# Altium schematic sheet DB10011_CANTranceiver.SchDoc: CAN Transceiver
size A4; Engineer: Danny Bokma; Revision: V0.3; SheetNumber: 6; SheetTotal: 7
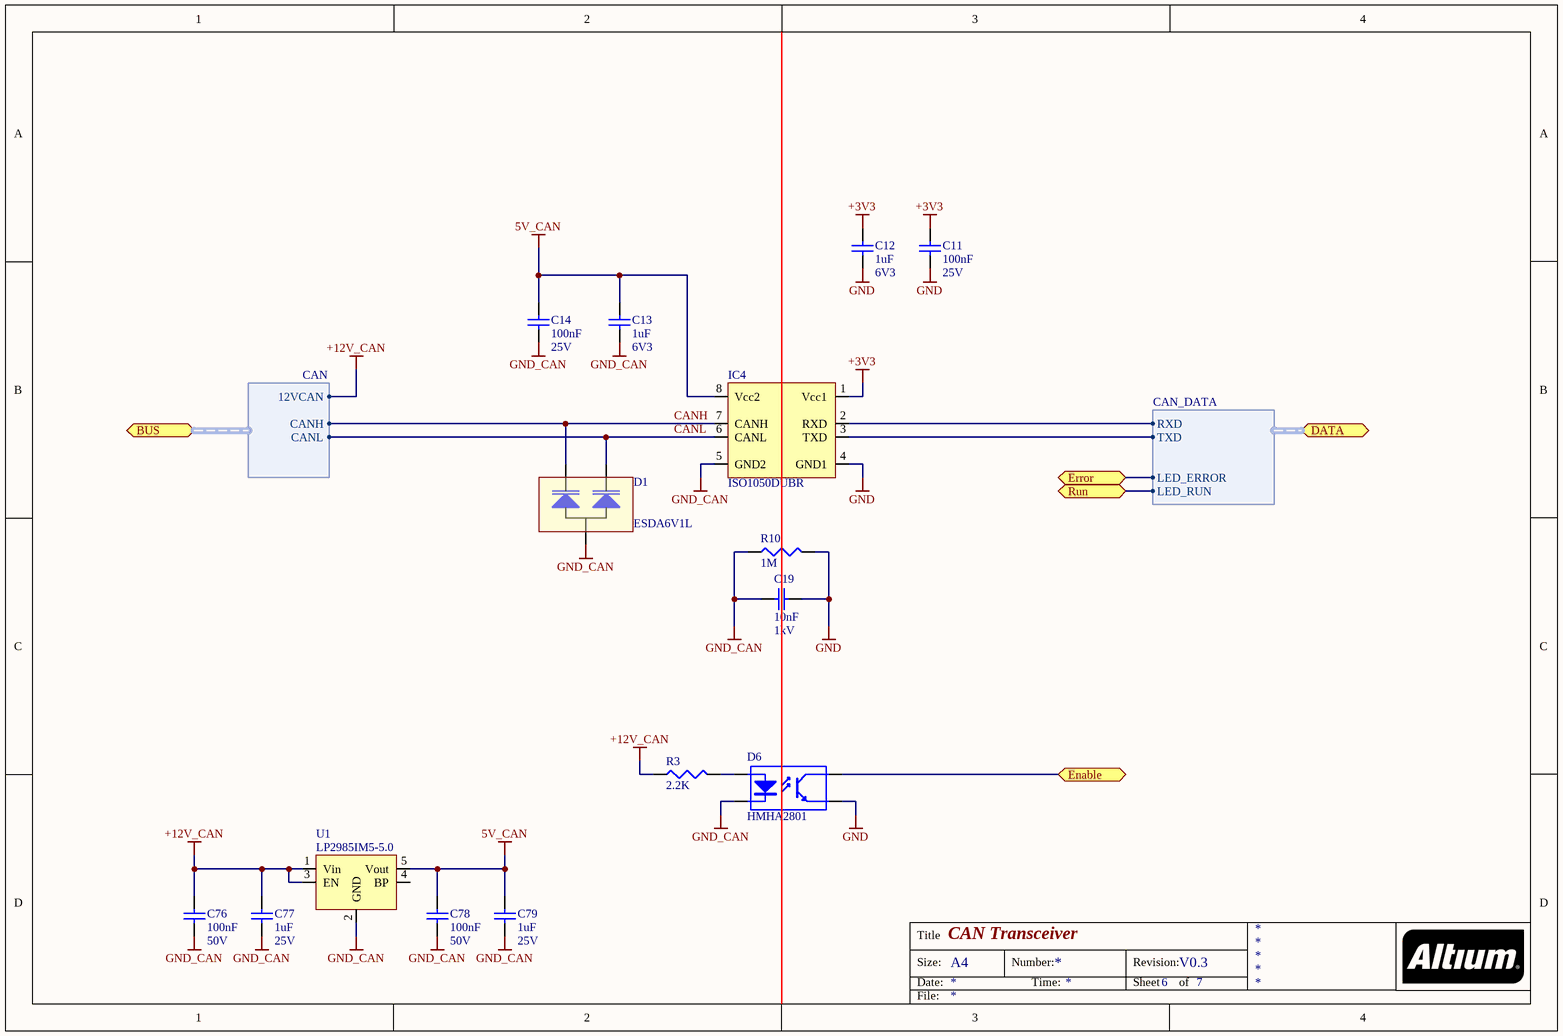
[diagram p0: DB10011_CANTranceiver.SchDoc]

## Parts
C11  100nF  Voltage Rating: 25V  [C0402]
C12  1uF  Voltage Rating: 6V3  [C0402]
C13  1uF  Voltage Rating: 6V3  [C0402]
C14  100nF  Voltage Rating: 25V  [C0402]
C19  10nF  Voltage Rating: 1kV  [C-1206]
C76  100nF  Voltage Rating: 50V  [C0603]
C77  1uF  Voltage Rating: 25V  [C0603]
C78  100nF  Voltage Rating: 50V  [C0603]
C79  1uF  Voltage Rating: 25V  [C0603]
D1  ESDA6V1L  [SOT23]
D6  HMHA2801  [FSOP4]
IC4  ISO1050DUBR  [PDSO8]
R3  2.2K  [0603]
R10  1M  [1206]
U1  LP2985IM5-5.0  [SOT-23-5]

## Ports
BUS (harness CAN), DATA (harness CAN_DATA), Enable, Error, Run

## Harnesses
CAN_DATA: RXD, TXD, LED_ERROR, LED_RUN
CAN: 12VCAN, CANL, CANH

## Nets
5V_CAN: C13.2 C14.2 C78.2 C79.2 IC4.8(Vcc2) U1.5(Vout)
+3V3: C11.2 C12.2 IC4.1(Vcc1)
+12V_CAN: C76.2 C77.2 R3.2 U1.1(Vin) U1.3(EN) ; port BUS.12VCAN
GND: C11.1 C12.1 C19.1 D6.3(E1) IC4.4(GND1) R10.1
GND_CAN: C13.1 C14.1 C19.2 C76.1 C77.1 C78.1 C79.1 D1.A D6.2(K1) IC4.5(GND2) R10.2 U1.2(GND)
CANH: D1.K1 IC4.7(CANH) ; port BUS.CANH
CANL: D1.K2 IC4.6(CANL) ; port BUS.CANL
Enable: D6.4(C1) ; port Enable
Error: port Error, port DATA.LED_ERROR
Run: port Run, port DATA.LED_RUN
NetD6_1: D6.1(A1) R3.1
NetIC4_2: IC4.2(RXD) ; port DATA.RXD
NetIC4_3: IC4.3(TXD) ; port DATA.TXD

Not connected (* = marked no-connect by the designer): U1 4(BP)

## Notes on the sheet
- Title
- Size:
- Date:
- A4
- Number:
- Time:
- Revision:
- Sheet
- of
- File:

## Library data of the parts
C11 C14 = 100nF/0402/CER/25V: Capacitor, 100nF, 25V, X7R; Capacitance Tolerance: 10nF; Capacitor Case Style: 0402; Brand Number: GRM155R71E104KE14D; Brand: MULTICOMP; Dielectric Characteristic: X7R; Capacitance: 100nF; Temperature Range: -55 to +125 C; Price: 0,0225; Order Code Supplier: 2456106; Supplier: Farnell
C12 C13 = 1uF/0402/CER/6.3V: Capacitor, 1uF, 6.3V, X5R; Capacitance Tolerance: ± 10%; Capacitor Case Style: 0402; Brand Number: 04026D105KAT2A; Brand: AVX; Dielectric Characteristic: X5R; Capacitance: 1uF; Temperature Range: -55°C to +85°C; Price: 0,0874; Order Code Supplier: 1327658; Supplier: Farnell
C19 = 10nF/1206/CER/1kV: Capacitor, F, 1kV, X7R; Capacitance Tolerance: ± 10%; Capacitor Case Style: 1206; Brand Number: GRM31CR73A103KW03L; Brand: Murata; Dielectric Characteristic: X7R; Capacitance: 10nF; Temperature Range: -55°C to +125°C; Price: 0,259; Order Code Supplier: 2494297; Supplier: Farnell
C76 C78 = 100nF/0603/CER/50V: Capacitor, 100nF, 50V, X7R; Capacitance Tolerance: ± 10%; Capacitor Case Style: 0603; Brand Number: MCCA000255; Brand: MULTICOMP; Dielectric Characteristic: X7R; Capacitance: 100nF; Temperature Range: -55°C to +125°C; Price: 0,008; Order Code Supplier: 1759122RL; Supplier: Farnell
C77 C79 = 1uF/0603/CER/25V: Capacitor, 1uF, 25V, X7R; Capacitance Tolerance: ± 10%; Capacitor Case Style: 0603; Brand Number: GRM188R71E105KA12D; Brand: MURATA; Dielectric Characteristic: X7R; Capacitance: 1uF; Temperature Range: -55°C to +125°C; Price: 0,186; Order Code Supplier: 1735540; Supplier: Farnell
D1 = ESDA6V1L: Diode TVS Dual, Vrwm: 5.25V, Vbr: 7.2V, Vc: 12.45V, Ippm: 15A; Brand: STMICROELECTRONICS; Case Style: SOT-23; Brand Number: ESDA6V1L; Breakdown Voltage: 7.2V; Clamping Voltage: 12.45V; Ippm: 15A; Order Code Supplier: 9802258; Price: 0,62; Supplier: Farnell; Temperature Range: -40°C to +125°C; Vrwm: 5.25V
D6 = HMHA2801: Optocoupler, Vout:80V, Iin:0.01A; Brand: FAIRCHILD SEMICONDUCTOR; Isolation Voltage: 2500V; Input Current: 0.01A; Output Voltage: 80V; Brand Number: HMHA2801; Case Style: *; Price: 0,28; Order Code Supplier: 1652504; Supplier: Farnell; Temperature Range: -55°C to +100°C
IC4 = ISO1050DUBR: CAN TRANSCEIVER; Brand: Texas Instruments; Case Style: SO8; Brand Number: ISO1050DUBR; Order Code Supplier: 1755712; Price: 5,44; Supplier: Farnell; Temperature Range: -55°C to +155°C
R3 = 2.2K/0603/0063W/50V: Resistor, 2.2K, 1%, 0.063W, 50V, 100PPM, 0603; Brand: VISHAY DRALORIC; Brand Number: CRCW06032K20FKEA; Case Style: 0603; Order Code Supplier: 2122405; Power Rating: 0.063W; Price: 0,038; Resistance: 2.2K; Supplier: Farnell; Temperature Coefficient: ± 100PPM; Temperature Range: -55°C to +125°C; Voltage Rating: 50V
R10 = 1M/1206/0300W/1kV: Resistor, 1M, 1%, 0.25W, 1kV, 200PPM, 1206; Brand: WELWYN; Brand Number: HVC1206-1M0FT3; Power Rating: 0.3W; Temperature Coefficient: ± 100PPM; Case Style: 1206; Order Code Supplier: 2340649; Price: 1,44; Resistance: 1M; Supplier: Farnell; Temperature Range: -55°C to +155°C; Voltage Rating: 1kV
U1 = LP2985IM5-5.0: LDO, 280mVDO, 5V, 0.15A, 1%; Brand: TEXAS INSTRUMENTS; Brand Number: LP2985IM5-5.0/NOPB; Vin-min: 2.5V; Vin-max: 16V; Case Style: SOT-23-5; Current: 0.15A; Vout: 5V; Order Code Supplier: 1564671; Price: 0,69; Supplier: Farnell; Temperature Range: -40°C to +85°C